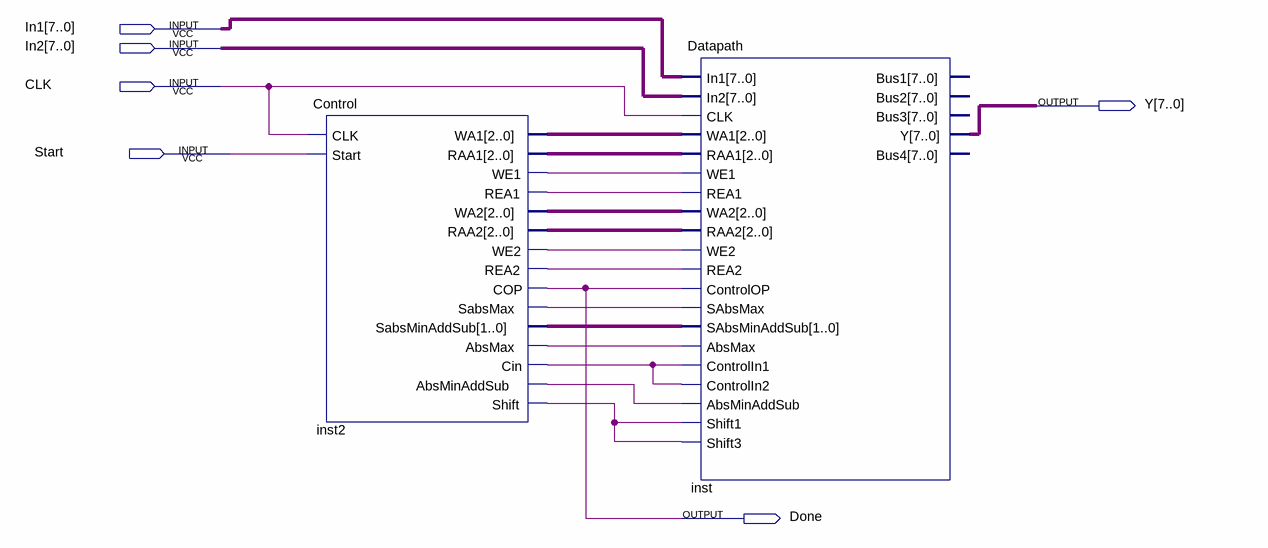
[diagram p0: schematic sheet]
// Quartus schematic Register_mer.bdf as structural Verilog: 2 symbols, 6 pins
module Register_mer (
  input  [7:0] In1,
  input  [7:0] In2,
  input  CLK,
  input  Start,
  output [7:0] Y,
  output Done
);

  wire inst2_absmax, inst2_absminaddsub, inst2_cin, inst2_rea1, inst2_rea2, inst2_sabsmax, inst2_shift,
       inst2_we1, inst2_we2;
  wire [1:0] inst2_sabsminaddsub;
  wire [2:0] inst2_raa1, inst2_raa2, inst2_wa1, inst2_wa2;

  Control inst2 (
    .CLK(CLK), .Start(Start), .WA1(inst2_wa1), .RAA1(inst2_raa1), .WE1(inst2_we1), .REA1(inst2_rea1),
    .WA2(inst2_wa2), .RAA2(inst2_raa2), .WE2(inst2_we2), .REA2(inst2_rea2), .COP(Done),
    .SabsMax(inst2_sabsmax), .SabsMinAddSub(inst2_sabsminaddsub), .AbsMax(inst2_absmax), .Cin(inst2_cin),
    .AbsMinAddSub(inst2_absminaddsub), .Shift(inst2_shift));
  Datapath inst (
    .In1(In1), .In2(In2), .CLK(CLK), .WA1(inst2_wa1), .RAA1(inst2_raa1), .WE1(inst2_we1), .REA1(inst2_rea1),
    .WA2(inst2_wa2), .RAA2(inst2_raa2), .WE2(inst2_we2), .REA2(inst2_rea2), .ControlOP(Done),
    .SAbsMax(inst2_sabsmax), .SAbsMinAddSub(inst2_sabsminaddsub), .AbsMax(inst2_absmax),
    .ControlIn1(inst2_cin), .ControlIn2(inst2_cin), .AbsMinAddSub(inst2_absminaddsub), .Shift1(inst2_shift),
    .Shift3(inst2_shift), .Y(Y));  // open: Bus1, Bus2, Bus3, Bus4
endmodule
